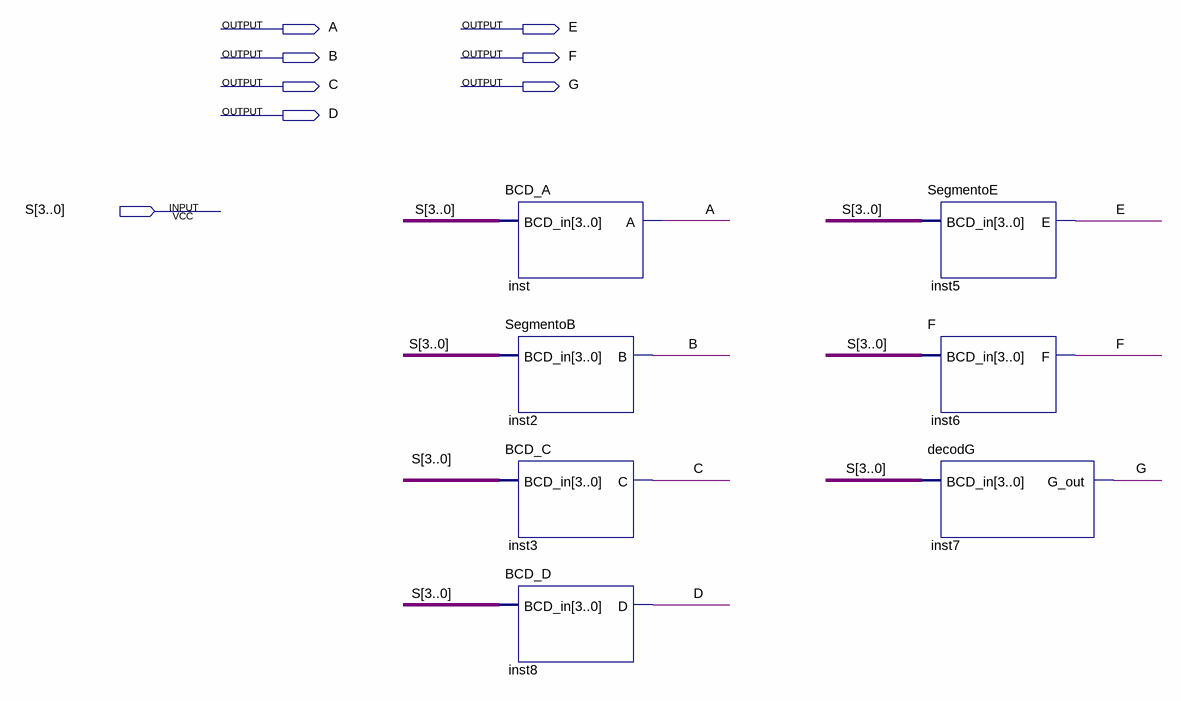
[diagram p0: schematic sheet]
// Quartus schematic display.bdf as structural Verilog: 7 symbols, 8 pins
module display (
  input  [3:0] S,
  output A,
  output E,
  output B,
  output F,
  output C,
  output G,
  output D
);

  BCD_A inst (.BCD_in(S), .A(A));
  SegmentoB inst2 (.BCD_in(S), .B(B));
  BCD_C inst3 (.BCD_in(S), .C(C));
  BCD_D inst8 (.BCD_in(S), .D(D));
  SegmentoE inst5 (.BCD_in(S), .E(E));
  F inst6 (.BCD_in(S), .F(F));
  decodG inst7 (.BCD_in(S), .G_out(G));
endmodule
